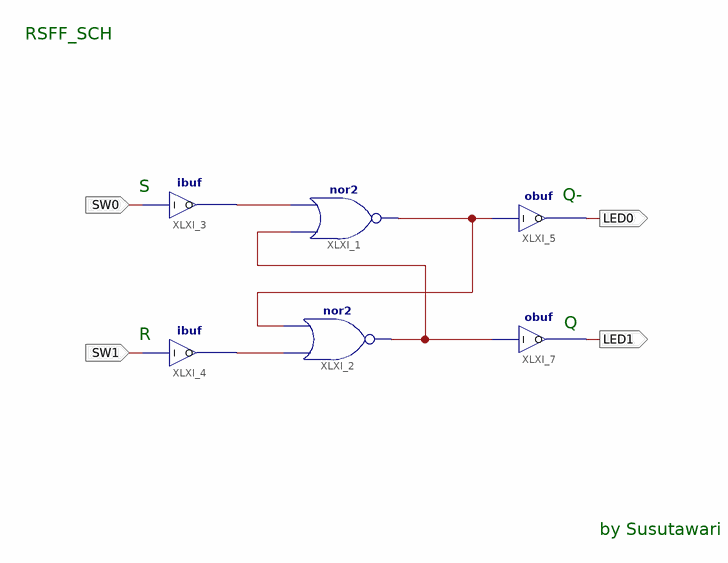
[diagram p0: schematic sheet 1]
// Xilinx ISE schematic RSFF_SCH.sch (spartan3e) as structural Verilog: 6 symbols, 4 ports
module RSFF_SCH (
  input  SW0,
  input  SW1,
  output LED0,
  output LED1
);

  wire XLXN_1, XLXN_2, XLXN_3, XLXN_4;

  nor XLXI_1 (XLXN_3, XLXN_4, XLXN_1);
  nor XLXI_2 (XLXN_4, XLXN_2, XLXN_3);
  ibuf XLXI_3 (.I(SW0), .O(XLXN_1));
  ibuf XLXI_4 (.I(SW1), .O(XLXN_2));
  obuf XLXI_5 (.I(XLXN_3), .O(LED0));
  obuf XLXI_7 (.I(XLXN_4), .O(LED1));

  // Notes on the sheet:
  //   RSFF_SCH
  //   S
  //   Q-
  //   Q
  //   R
  //   by Susutawari
endmodule
